# Altium schematic sheet Mainboard_Motordriver_Interface.SchDoc
size A4
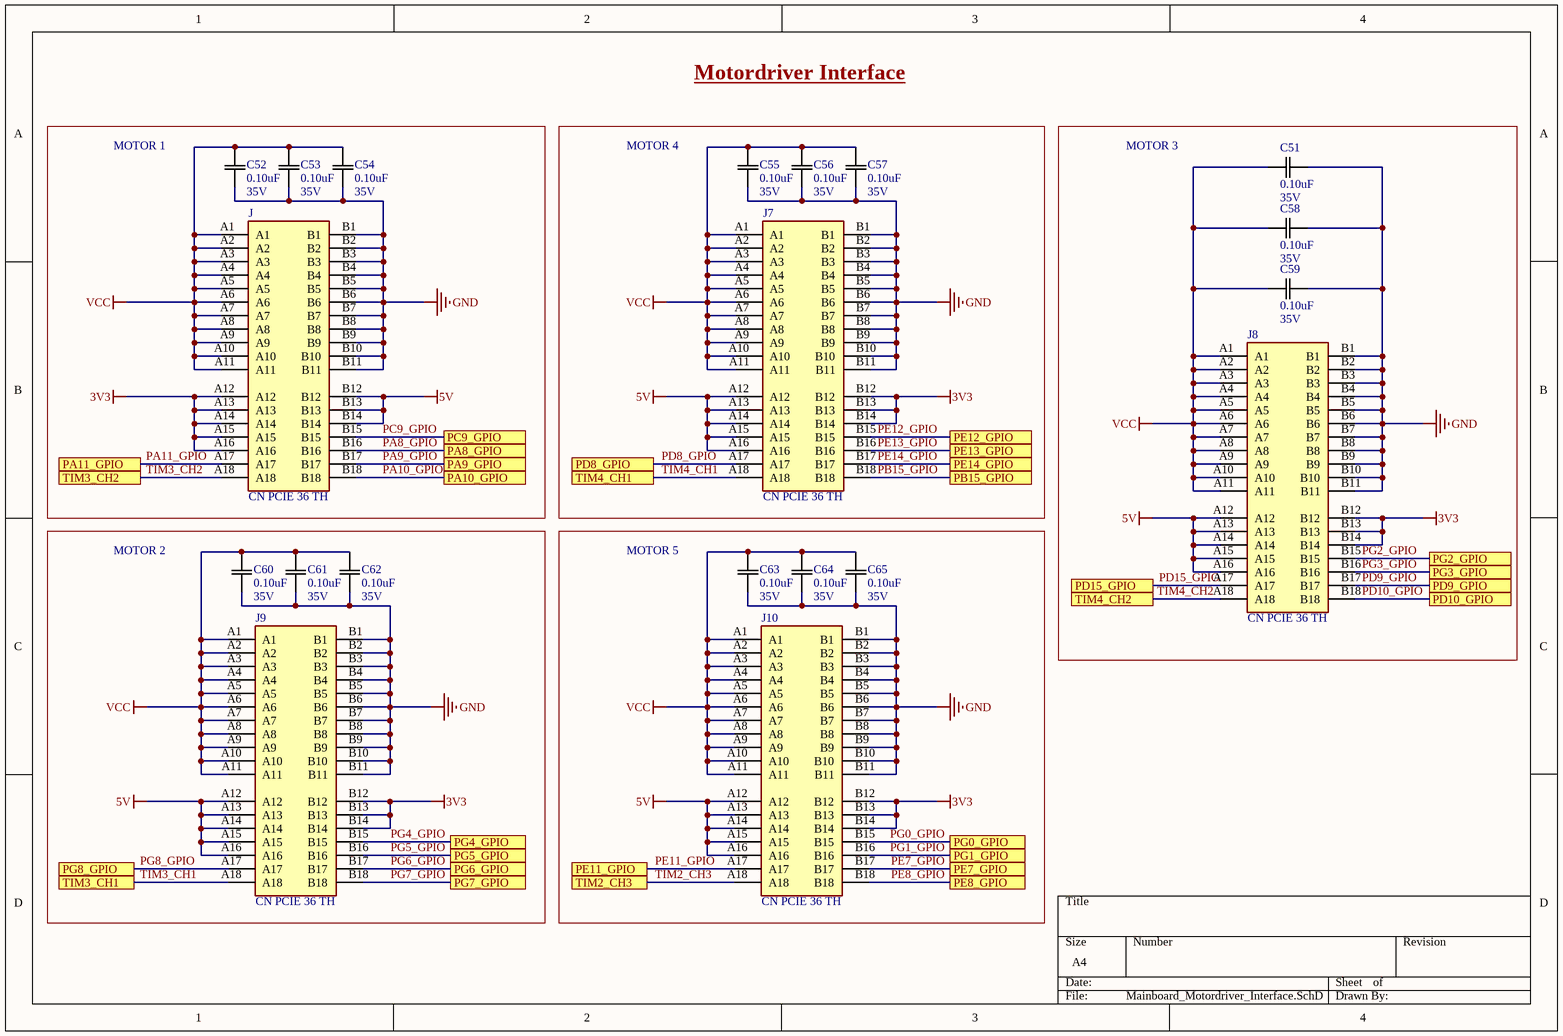
[diagram p0: Mainboard_Motordriver_Interface.SchDoc]

## Parts
C51  Rating: 35V  [0603]  (hidden comment: 0.10uF)
C52  Rating: 35V  [0603]  (hidden comment: 0.10uF)
C53  Rating: 35V  [0603]  (hidden comment: 0.10uF)
C54  Rating: 35V  [0603]  (hidden comment: 0.10uF)
C55  Rating: 35V  [0603]  (hidden comment: 0.10uF)
C56  Rating: 35V  [0603]  (hidden comment: 0.10uF)
C57  Rating: 35V  [0603]  (hidden comment: 0.10uF)
C58  Rating: 35V  [0603]  (hidden comment: 0.10uF)
C59  Rating: 35V  [0603]  (hidden comment: 0.10uF)
C60  Rating: 35V  [0603]  (hidden comment: 0.10uF)
C61  Rating: 35V  [0603]  (hidden comment: 0.10uF)
C62  Rating: 35V  [0603]  (hidden comment: 0.10uF)
C63  Rating: 35V  [0603]  (hidden comment: 0.10uF)
C64  Rating: 35V  [0603]  (hidden comment: 0.10uF)
C65  Rating: 35V  [0603]  (hidden comment: 0.10uF)
J  CN PCIE 36 TH  [CN PCIE 36 TH]
J7  CN PCIE 36 TH  [CN PCIE 36 TH]
J8  CN PCIE 36 TH  [CN PCIE 36 TH]
J9  CN PCIE 36 TH  [CN PCIE 36 TH]
J10  CN PCIE 36 TH  [CN PCIE 36 TH]

## Blocks framed on the sheet
MOTOR 1: C52-C54 J
MOTOR 4: C55-C57 J7
MOTOR 3: C51 C58 C59 J8
MOTOR 2: C60-C62 J9
MOTOR 5: C63-C65 J10

## Ports
PA8_GPIO, PA9_GPIO, PA10_GPIO, PA11_GPIO, PB15_GPIO, PC9_GPIO, PD8_GPIO, PD9_GPIO, PD10_GPIO, PD15_GPIO, PE7_GPIO, PE8_GPIO, PE11_GPIO, PE12_GPIO, PE13_GPIO, PE14_GPIO, PG0_GPIO, PG1_GPIO, PG2_GPIO, PG3_GPIO, PG4_GPIO, PG5_GPIO, PG6_GPIO, PG7_GPIO, PG8_GPIO, TIM2_CH3, TIM3_CH1, TIM3_CH2, TIM4_CH1, TIM4_CH2

## Nets
3V3: J.A12 J.A13 J.A14 J.A15 J.A16 J7.B12 J7.B13 J7.B14 J8.B12 J8.B13 J8.B14 J9.B12 J9.B13 J9.B14 J10.B12 J10.B13 J10.B14
5V: J.B12 J.B13 J.B14 J7.A12 J7.A13 J7.A14 J7.A15 J7.A16 J8.A12 J8.A13 J8.A14 J8.A15 J8.A16 J9.A12 J9.A13 J9.A14 J9.A15 J9.A16 J10.A12 J10.A13 J10.A14 J10.A15 J10.A16
GND: C51.1(C1) C52.1(C1) C53.1(C1) C54.1(C1) C55.1(C1) C56.1(C1) C57.1(C1) C58.1(C1) C59.1(C1) C60.1(C1) C61.1(C1) C62.1(C1) C63.1(C1) C64.1(C1) C65.1(C1) J.B1 J.B2 J.B3 J.B4 J.B5 J.B6 J.B7 J.B8 J.B9 J.B10 J.B11 J7.B1 J7.B2 J7.B3 J7.B4 J7.B5 J7.B6 J7.B7 J7.B8 J7.B9 J7.B10 J7.B11 J8.B1 J8.B2 J8.B3 J8.B4 J8.B5 J8.B6 J8.B7 J8.B8 J8.B9 J8.B10 J8.B11 J9.B1 J9.B2 J9.B3 J9.B4 J9.B5 J9.B6 J9.B7 J9.B8 J9.B9 J9.B10 J9.B11 J10.B1 J10.B2 J10.B3 J10.B4 J10.B5 J10.B6 J10.B7 J10.B8 J10.B9 J10.B10 J10.B11
VCC: C51.2(C2) C52.2(C2) C53.2(C2) C54.2(C2) C55.2(C2) C56.2(C2) C57.2(C2) C58.2(C2) C59.2(C2) C60.2(C2) C61.2(C2) C62.2(C2) C63.2(C2) C64.2(C2) C65.2(C2) J.A1 J.A2 J.A3 J.A4 J.A5 J.A6 J.A7 J.A8 J.A9 J.A10 J.A11 J7.A1 J7.A2 J7.A3 J7.A4 J7.A5 J7.A6 J7.A7 J7.A8 J7.A9 J7.A10 J7.A11 J8.A1 J8.A2 J8.A3 J8.A4 J8.A5 J8.A6 J8.A7 J8.A8 J8.A9 J8.A10 J8.A11 J9.A1 J9.A2 J9.A3 J9.A4 J9.A5 J9.A6 J9.A7 J9.A8 J9.A9 J9.A10 J9.A11 J10.A1 J10.A2 J10.A3 J10.A4 J10.A5 J10.A6 J10.A7 J10.A8 J10.A9 J10.A10 J10.A11
PA8_GPIO: J.B16 ; port PA8_GPIO
PA9_GPIO: J.B17 ; port PA9_GPIO
PA10_GPIO: J.B18 ; port PA10_GPIO
PA11_GPIO: J.A17 ; port PA11_GPIO
PB15_GPIO: J7.B18 ; port PB15_GPIO
PC9_GPIO: J.B15 ; port PC9_GPIO
PD8_GPIO: J7.A17 ; port PD8_GPIO
PD9_GPIO: J8.B17 ; port PD9_GPIO
PD10_GPIO: J8.B18 ; port PD10_GPIO
PD15_GPIO: J8.A17 ; port PD15_GPIO
PE7_GPIO: J10.B17 ; port PE7_GPIO
PE8_GPIO: J10.B18 ; port PE8_GPIO
PE11_GPIO: J10.A17 ; port PE11_GPIO
PE12_GPIO: J7.B15 ; port PE12_GPIO
PE13_GPIO: J7.B16 ; port PE13_GPIO
PE14_GPIO: J7.B17 ; port PE14_GPIO
PG0_GPIO: J10.B15 ; port PG0_GPIO
PG1_GPIO: J10.B16 ; port PG1_GPIO
PG2_GPIO: J8.B15 ; port PG2_GPIO
PG3_GPIO: J8.B16 ; port PG3_GPIO
PG4_GPIO: J9.B15 ; port PG4_GPIO
PG5_GPIO: J9.B16 ; port PG5_GPIO
PG6_GPIO: J9.B17 ; port PG6_GPIO
PG7_GPIO: J9.B18 ; port PG7_GPIO
PG8_GPIO: J9.A17 ; port PG8_GPIO
TIM2_CH3: J10.A18 ; port TIM2_CH3
TIM3_CH1: J9.A18 ; port TIM3_CH1
TIM3_CH2: J.A18 ; port TIM3_CH2
TIM4_CH1: J7.A18 ; port TIM4_CH1
TIM4_CH2: J8.A18 ; port TIM4_CH2

## Notes on the sheet
- Motordriver Interface

## Library data of the parts
C51-C65 = CAP 0.10uF 35V: CAP CER 0.10UF 35V X7R 0603/0805; Tolerance: 10%; Package: 0603/0805; Temperature Coefficient: X7R; Operating Temperature: -55°C ~ 125°C; Value: 0.10uF
J J7-J10 = CN PCIE 36 TH: 36 Position Female Connector PCI Expressâ„¢ Gold 0.039 _1.00mm_ Black 10018784-10210TLF; MF: Amphenol ICC; Price: None; SnapEDA_Link: https://www.snapeda.com/parts/10018784-10210TLF/Amphenol%20FCI/view-part/520950/?ref=snap; Availability: Unavailable; MP: 10018784-10210TLF; Package: None; Value: *